# EAGLE design ppm_encoder_402_crystal (EAGLE 5.07)
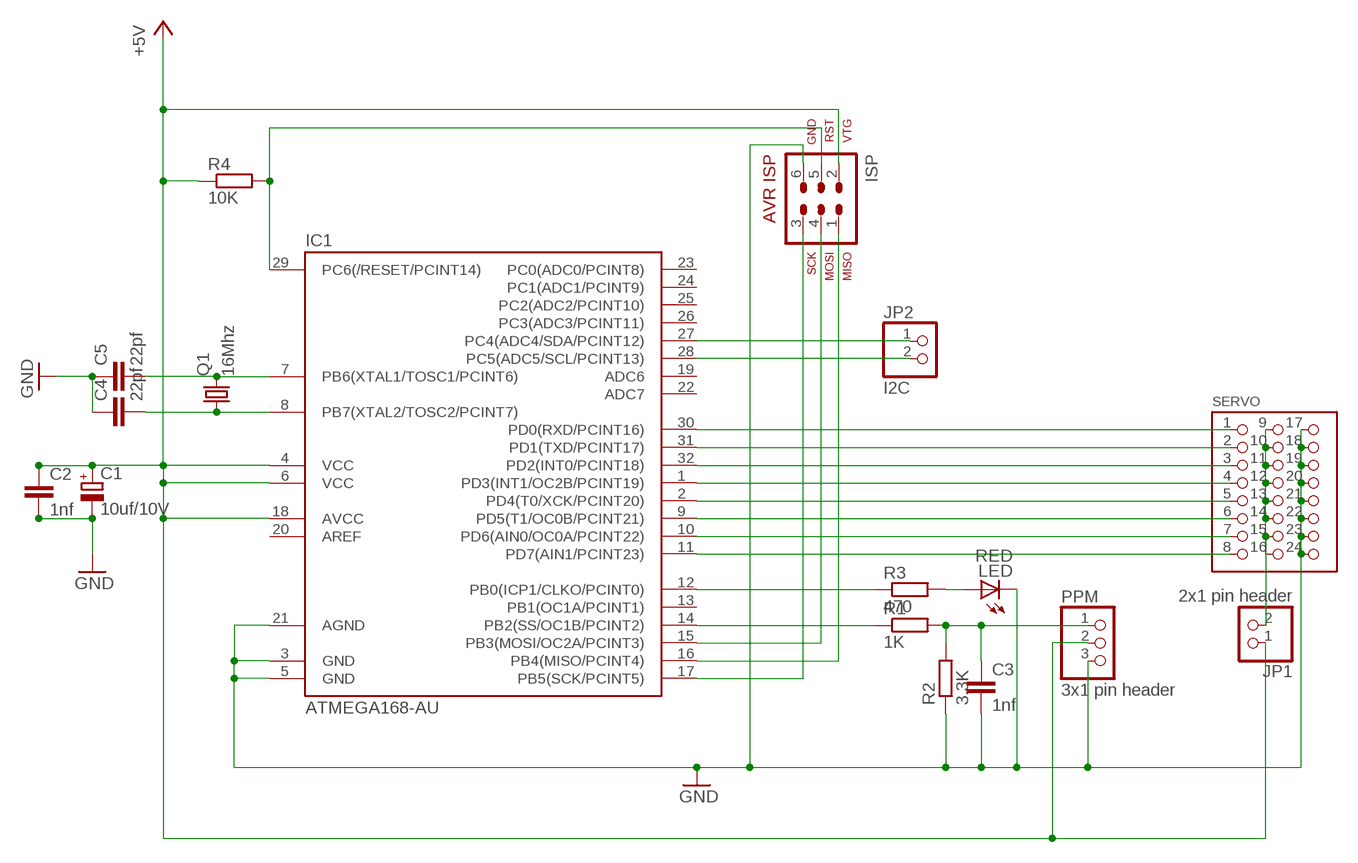
[diagram p0: schematic, sheet 1]

## Parts
C1  10uf/10V  CPOL-EUB/3528-21R  [B/3528-21R]
C2  1nf  C-EUC0402  [C0402]
C3  1nf  C-EUC0402  [C0402]
C4  22pf  C-EUC0402  [C0402]
C5  22pf  C-EUC0402  [C0402]
IC1  ATMEGA168-AU  MEGA48/88/168-AU  [TQFP32-08]
ISP  AVR-ISP-6  [AVR-ISP-6]
JP1  2x1 pin header  PINHD-1X2  [1X02]
JP2  I2C  PINHD-1X2  [1X02]
LED  RED  LEDCHIP-LED0603  [CHIP-LED0603]
PPM  3x1 pin header  PINHD-1X3  [1X03]
Q1  16Mhz  CRYSTALCTS406  [CTS406]
R1  1K  R-EU_R0402  [R0402]
R2  3.3K  R-EU_R0402  [R0402]
R3  470  R-EU_R0402  [R0402]
R4  10K  R-EU_R0402  [R0402]
SERVO  3x8 pin header  PIN_3X8  [PIN_3X8]

## Nets
+5: JP1.2 SERVO.9 SERVO.10 SERVO.11 SERVO.12 SERVO.13 SERVO.14 SERVO.15 SERVO.16
+5V: C1.+ C2.1 IC1.4(VCC) IC1.6(VCC) IC1.18(AVCC) ISP.2 JP1.1 PPM.2 R4.1
GND: C1.- C2.2 C3.2 C4.1 C5.1 IC1.3(GND) IC1.5(GND) IC1.21(AGND) ISP.6 LED.C PPM.3 R2.1 SERVO.17 SERVO.18 SERVO.19 SERVO.20 SERVO.21 SERVO.22 SERVO.23 SERVO.24
N$1: IC1.30(PD0(RXD/PCINT16)) SERVO.1
N$2: IC1.31(PD1(TXD/PCINT17)) SERVO.2
N$3: IC1.32(PD2(INT0/PCINT18)) SERVO.3
N$4: IC1.1(PD3(INT1/OC2B/PCINT19)) SERVO.4
N$5: IC1.2(PD4(T0/XCK/PCINT20)) SERVO.5
N$6: IC1.9(PD5(T1/OC0B/PCINT21)) SERVO.6
N$7: IC1.10(PD6(AIN0/OC0A/PCINT22)) SERVO.7
N$8: IC1.11(PD7(AIN1/PCINT23)) SERVO.8
N$9: IC1.12(PB0(ICP1/CLKO/PCINT0)) R3.1
N$10: IC1.14(PB2(SS/OC1B/PCINT2)) R1.1
N$11: C3.1 PPM.1 R1.2 R2.2
N$12: LED.A R3.2
N$13: IC1.16(PB4(MISO/PCINT4)) ISP.1
N$14: IC1.15(PB3(MOSI/OC2A/PCINT3)) ISP.4
N$15: IC1.17(PB5(SCK/PCINT5)) ISP.3
N$16: IC1.29(PC6(/RESET/PCINT14)) ISP.5 R4.2
N$17: C5.2 IC1.7(PB6(XTAL1/TOSC1/PCINT6)) Q1.3
N$18: IC1.28(PC5(ADC5/SCL/PCINT13)) JP2.2
N$19: C4.2 IC1.8(PB7(XTAL2/TOSC2/PCINT7)) Q1.1
N$20: IC1.27(PC4(ADC4/SDA/PCINT12)) JP2.1
Unconnected: IC1.13(PB1(OC1A/PCINT1)) IC1.19(ADC6) IC1.20(AREF) IC1.22(ADC7) IC1.23(PC0(ADC0/PCINT8)) IC1.24(PC1(ADC1/PCINT9)) IC1.25(PC2(ADC2/PCINT10)) IC1.26(PC3(ADC3/PCINT11))

## Library data of the parts
C1 = rcl:CPOL-EU: POLARIZED CAPACITOR, European symbol
C2-C5 = rcl:C-EU: CAPACITOR, European symbol
IC1 = avr-4:MEGA48/88/168
ISP = avr-4:AVR-ISP-6: AVR ISP-6 Serial Programming Header
JP1 JP2 = pinhead:PINHD-1X2: PIN HEADER
LED = led:LED: LED OSRAM: - CHIPLED LG R971, LG N971, LY N971, LG Q971, LY Q971, LO R971, LY R971 LH N974, LH R974 LS Q976, LO Q976, LY Q976 LO Q996 - Hyper CHIPLED LW Q18S LB Q993, LB Q99A, LB R99A - SideLED LS A670, LO A670, LY A670, LG A670, LP A670 LB A673, LV A673, LT A673, LW A673 LH A674 LY A675 LS A676, LA A676, LO A676, LY A676, LW A676 LS A679, LY A679, LG A679 - Hyper Micro SIDELED® LS Y876, LA Y876, LO Y876, LY Y876 LT Y87S - SmartLED LW L88C, LW L88S LB L89C, LB L89S, LG L890 LS L89K, LO L89K, LY L89K LS L896, LA L896, LO L896, LY L896 - TOPLED LS T670, LO T670, LY T670, LG T670, LP T670 LSG T670, LSP T670, LSY T670, LOP T670, LYG T670 LG T671, LOG T671, LSG T671 LB T673, LV T673, LT T673, LW T673 LH T674 LS T676, LA T676, LO T676, LY T676, LB T676, LH T676, LSB T676, LW T676 LB T67C, LV T67C, LT T67C, LS T67K, LO T67K, LY T67K, LW E67C LS E67B, LA E67B, LO E67B, LY E67B, LB E67C, LV E67C, LT E67C LW T67C LS T679, LY T679, LG T679 LS T770, LO T770, LY T770, LG T770, LP T770 LB T773, LV T773, LT T773, LW T773 LH T774 LS E675, LA E675, LY E675, LS T675 LS T776, LA T776, LO T776, LY T776, LB T776 LHGB T686 LT T68C, LB T68C - Hyper Mini TOPLED® LB M676 - Mini TOPLED Santana® LG M470 LS M47K, LO M47K, LY M47K Source: http://www.osram.convergy.de LUXEON: - LUMILED® LXK2-PW12-R00, LXK2-PW12-S00, LXK2-PW14-U00, LXK2-PW14-V00 LXK2-PM12-R00, LXK2-PM12-S00, LXK2-PM14-U00 LXK2-PE12-Q00, LXK2-PE12-R00, LXK2-PE12-S00, LXK2-PE14-T00, LXK2-PE14-U00 LXK2-PB12-K00, LXK2-PB12-L00, LXK2-PB12-M00, LXK2-PB14-N00, LXK2-PB14-P00, LXK2-PB14-Q00 LXK2-PR12-L00, LXK2-PR12-M00, LXK2-PR14-Q00, LXK2-PR14-R00 LXK2-PD12-Q00, LXK2-PD12-R00, LXK2-PD12-S00 LXK2-PH12-R00, LXK2-PH12-S00 LXK2-PL12-P00, LXK2-PL12-Q00, LXK2-PL12-R00 Source: www.luxeon.com KINGBRIGHT: KA-3528ASYC Source: www.kingbright.com
PPM = pinhead:PINHD-1X3: PIN HEADER
Q1 = crystal:CRYSTAL: CRYSTAL
R1-R4 = rcl:R-EU_: RESISTOR, European symbol
SERVO = pinhead_3row:PIN_3X8

## Board
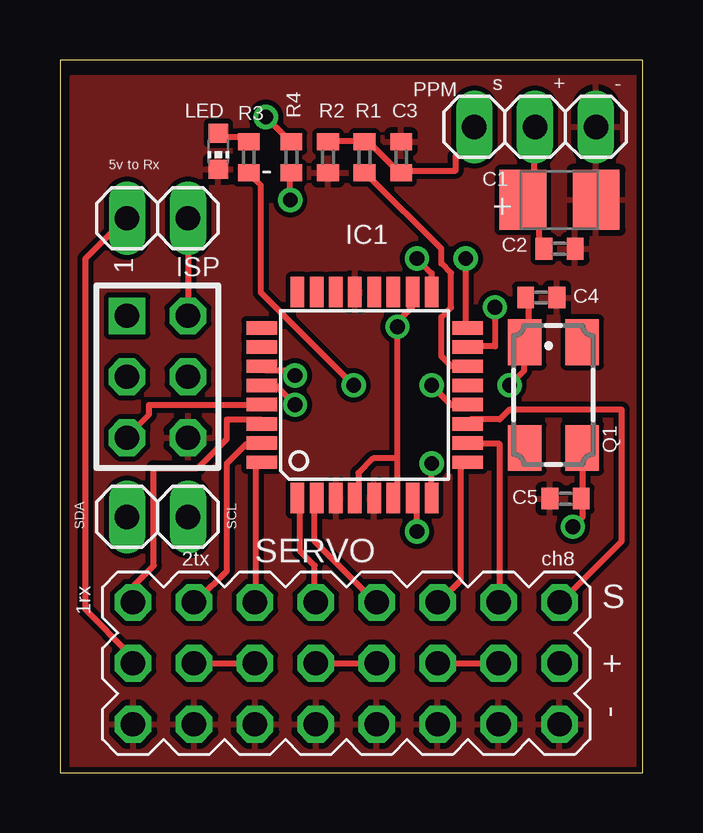
[diagram p1: board, top side]
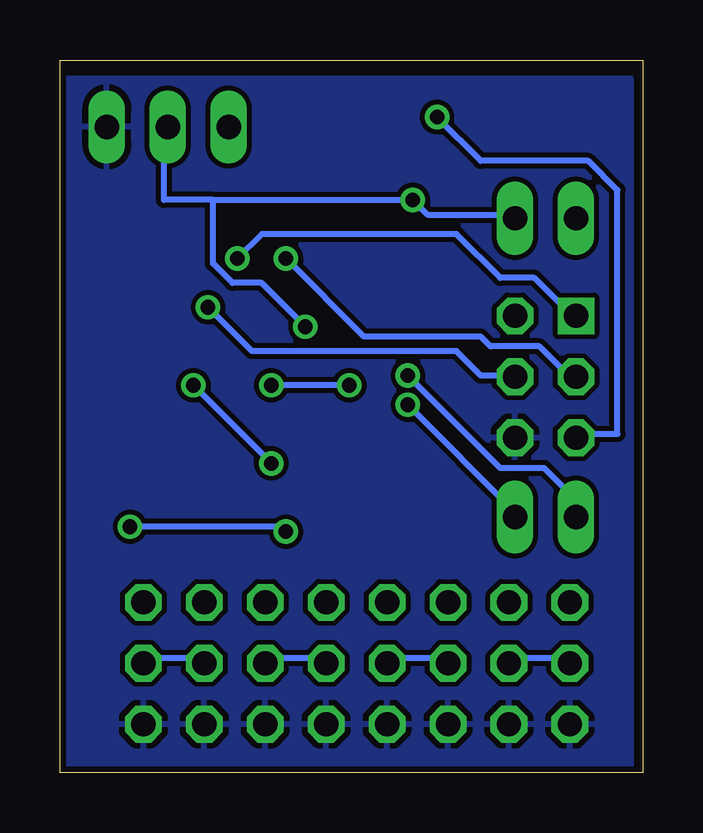
[diagram p2: board, bottom side, seen from below]

Size 24.31 x 29.71 mm. Coordinates in mm from the lower left corner, seen from the top.
Outline: 0,0 24.31,0 24.31,29.71 0,29.71 0,0
Copper layers (1*16): Top 0.035mm / dielectric 1.5mm / Bottom 0.035mm
Design rules "default *": minimum track width 10mil, minimum drill 24mil, track to track 8mil, track to pad 8mil, pad to pad 8mil, via to via 8mil, smd to smd 8mil, copper to edge 10mil, drill to drill 8mil, minimum pad ring 10mil, minimum via ring 8mil, stop-mask expansion 4mil, vias tented up to drill 0mil, thermal gap 10mil

### Footprints (pad centres in the part's own frame; a part is rotated, then mirrored left to right if it is on the bottom)
B/3528-21R = smd 1.95 x 2.5: + 1.525,0; - -1.525,0
C0402 = smd 0.7 x 0.9: 1 -0.65,0; 2 0.65,0
TQFP32-08 = smd 1.27 x 0.559: 1 -4.293,2.8; 2 -4.293,2; 3 -4.293,1.2; 4 -4.293,0.4; 5 -4.293,-0.4; 6 -4.293,-1.2; 7 -4.293,-2; 8 -4.293,-2.8; 17 4.293,-2.8; 18 4.293,-2; 19 4.293,-1.2; 20 4.293,-0.4; 21 4.293,0.4; 22 4.293,1.2; 23 4.293,2; 24 4.293,2.8 | smd 0.559 x 1.27: 9 -2.8,-4.293; 10 -2,-4.293; 11 -1.2,-4.293; 12 -0.4,-4.293; 13 0.4,-4.293; 14 1.2,-4.293; 15 2,-4.293; 16 2.8,-4.293; 25 2.8,4.293; 26 2,4.293; 27 1.2,4.293; 28 0.4,4.293; 29 -0.4,4.293; 30 -1.2,4.293; 31 -2,4.293; 32 -2.8,4.293
AVR-ISP-6 = drill 1.016 square: 1 -2.54,-1.27 | drill 1.016 octagon: 2 -2.54,1.27; 3 0,-1.27; 4 0,1.27; 5 2.54,-1.27; 6 2.54,1.27
1X02 = drill 1.016 long: 1 -1.27,0; 2 1.27,0
CHIP-LED0603 = smd 0.8 x 0.8: A 0,-0.75; C 0,0.75
1X03 = drill 1.016 long: 1 -2.54,0; 2 0,0; 3 2.54,0
CTS406 = smd 1.9 x 1.4: 1 -2.2,-1.2; 2 2.2,-1.2; 3 2.2,1.2; 4 -2.2,1.2
R0402 = smd 0.7 x 0.9: 1 -0.65,0; 2 0.65,0
PIN_3X8 = drill 1.016 octagon: 1 1.27,-1.27; 2 3.81,-1.27; 3 6.35,-1.27; 4 8.89,-1.27; 5 11.43,-1.27; 6 13.97,-1.27; 7 16.51,-1.27; 8 19.05,-1.27; 9 1.27,-3.81; 10 3.81,-3.81; 11 6.35,-3.81; 12 8.89,-3.81; 13 11.43,-3.81; 14 13.97,-3.81; 15 16.51,-3.81; 16 19.05,-3.81; 17 1.27,-6.35; 18 3.81,-6.35; 19 6.35,-6.35; 20 8.89,-6.35; 21 11.43,-6.35; 22 13.97,-6.35; 23 16.51,-6.35; 24 19.05,-6.35

### Placement (x,y rotation side)
C1  20.83,23.88 180 top
C2  20.83,21.84 0 top
C3  14.22,25.65 90 top
C4  20.07,19.81 180 top
C5  21.08,11.43 0 top
IC1  12.7,15.75 90 top
ISP  4.06,16.51 270 top
JP1  4.06,23.11 180 top
JP2  4.06,10.67 0 top
LED  6.6,25.91 180 top
PPM  19.81,26.92 0 top
Q1  20.57,15.75 270 top
R1  12.7,25.65 90 top
R2  11.18,25.65 90 top
R3  7.87,25.65 90 top
R4  9.65,25.65 90 top
SERVO  1.78,8.38 0 top

### Tracks (layer width: path | path; a pad name or v marks a point on that pad's centre or on a via)
+5
  Top 0.254: SERVO.14 SERVO.15 | SERVO.12 SERVO.13 | SERVO.10 SERVO.11 | JP1.2 2.69,23.06 1.07,21.44 1.07,6.81 2.9,4.98 2.9,4.57 SERVO.9
  Bottom 0.254: SERVO.16 20.78,4.57 20.57,4.78 18.54,4.78 18.34,4.57 SERVO.15 | SERVO.9 3.1,4.57 3.3,4.78 5.33,4.78 5.54,4.57 SERVO.10 | SERVO.12 10.62,4.57 10.41,4.78 8.38,4.78 8.18,4.57 SERVO.11 | SERVO.14 15.7,4.57 15.49,4.78 13.46,4.78 13.26,4.57 SERVO.13
+5V  (via drill 0.61)
  Top 0.254: 14.07,13.11 13.06,13.11 12.45,12.5 12.45,11.48 IC1.4 | 14.07,13.11 14.07,11.48 IC1.6 | 14.07,13.11 v14.07,18.59 14.07,18.8 14.68,19.41 14.68,20.02 IC1.18 | 19.35,23.88 19.96,23.27 19.96,22.05 C2.1 | 19.35,23.88 19.76,24.28 19.76,26.92 PPM.2 | 19.35,23.88 C1.+ | v9.6,23.88 9.6,24.89 R4.1 | JP1.1 ISP.2
  Bottom 0.254: JP1.1 5.33,23.27 8.99,23.27 v9.6,23.88 17.93,23.88 | 17.93,23.88 19.96,23.88 19.96,26.92 PPM.2 | v14.07,18.59 15.9,20.42 17.12,20.42 17.93,21.23 17.93,23.88
GND
  pour Bottom: 0.51,28.96 0.51,0.25 24.13,0.25 24.13,28.96
  pour Top: 0.51,28.96 0.51,0.25 24.13,0.25 24.13,28.96
N$1
  Top 0.254: IC1.30 8.38,14.73 6.96,14.73 6.96,13.92 5.74,12.7 3.91,12.7 3.91,8.64 3.1,7.82 3.1,7.21 SERVO.1
N$2
  Top 0.254: IC1.31 8.38,13.72 7.77,13.72 6.96,12.9 6.96,8.43 5.74,7.21 SERVO.2
N$3
  Top 0.254: IC1.32 8.38,12.9 8.18,12.7 8.18,7.21 SERVO.3
N$4
  Top 0.254: IC1.1 10.01,11.28 10.01,9.25 10.62,8.64 10.62,7.21 SERVO.4
N$5
  Top 0.254: IC1.2 10.62,11.28 10.62,9.65 13.06,7.21 SERVO.5
N$6
  Top 0.254: IC1.9 16.92,12.9 16.71,12.7 16.71,8.03 15.9,7.21 SERVO.6
N$7
  Top 0.254: IC1.10 17.12,13.72 18.34,13.72 18.34,7.21 SERVO.7
N$8
  Top 0.254: IC1.11 17.12,14.73 18.34,14.73 18.74,15.14 23.42,15.14 23.42,9.65 20.98,7.21 SERVO.8
N$9  (via drill 0.61)
  Top 0.254: v12.24,16.15 8.38,20.02 8.38,24.49 7.98,24.89 R3.1 | v15.49,16.15 16.31,15.34 16.92,15.34 IC1.12
  Bottom 0.254: v12.24,16.15 v15.49,16.15
N$10
  Top 0.254: R1.1 12.85,24.89 15.9,21.84 15.9,21.23 16.31,20.83 16.31,19.41 15.9,19 15.9,17.37 16.31,16.97 16.92,16.97 IC1.14
N$11
  Top 0.254: R2.2 11.23,26.31 12.65,26.31 R1.2 12.85,26.31 14.07,25.1 C3.1 14.27,25.1 16.51,25.1 16.51,25.71 17.12,26.31 17.12,26.92 PPM.1
N$12
  Top 0.254: LED.A 6.76,26.52 7.77,26.52 7.77,26.31 R3.2
N$13  (via drill 0.61)
  Top 0.254: v16.92,21.44 16.92,18.59 IC1.16
  Bottom 0.254: v16.92,21.44 15.9,22.45 7.77,22.45 5.94,20.63 4.52,20.63 3.1,19.2 2.9,19.2 ISP.1
N$14  (via drill 0.61)
  Top 0.254: v18.14,19.41 18.14,17.78 17.12,17.78 IC1.15
  Bottom 0.254: v18.14,19.41 16.31,17.58 7.77,17.58 6.76,16.56 5.33,16.56 ISP.4
N$15  (via drill 0.61)
  Top 0.254: v14.88,21.44 15.49,20.83 15.49,20.22 IC1.17
  Bottom 0.254: v14.88,21.44 11.63,18.19 6.76,18.19 6.35,17.78 4.32,17.78 3.1,16.56 2.9,16.56 ISP.3
N$16  (via drill 0.61)
  Top 0.254: v8.58,27.33 9.6,26.31 R4.2 | IC1.29 8.38,15.34 3.71,15.34 3.71,14.94 2.9,14.12 ISP.5
  Bottom 0.254: v8.58,27.33 6.76,25.5 2.29,25.5 1.07,24.28 1.07,14.12 2.69,14.12 ISP.5
N$17  (via drill 0.61)
  Top 0.254: Q1.3 21.79,13.51 21.79,11.48 C5.2 21.79,11.28 21.79,10.67 v21.39,10.26 | v14.88,10.06 14.88,11.28 IC1.7
  Bottom 0.254: v14.88,10.06 15.09,10.26 v21.39,10.26
N$18  (via drill 0.61)
  Top 0.254: v9.8,15.34 8.99,16.15 8.58,16.15 IC1.28
  Bottom 0.254: v9.8,15.34 5.33,10.87 JP2.2
N$19  (via drill 0.61)
  Top 0.254: C4.2 19.56,19.81 19.56,17.98 Q1.1 19.35,17.78 19.35,16.76 v18.74,16.15 | v15.49,12.9 15.49,11.48 IC1.8
  Bottom 0.254: v15.49,12.9 v18.74,16.15
N$20  (via drill 0.61)
  Top 0.254: v9.8,16.56 9.8,16.76 8.58,16.76 IC1.27
  Bottom 0.254: v9.8,16.56 5.94,12.7 4.11,12.7 2.9,11.48 2.9,10.67 JP2.1

### Text on the board
tNames: PPM | s | + | - | 5v to Rx | - | + | 1 | SDA | SCL | 2tx | ch8 | S | 1rx | + | -